# Altium schematic sheet POWR0005.SchDoc: BLUEsat Power Switch
size A3; Engineer: Ekramul Nafis Islam; Organization: BLUEsat; Address1: Room 419; Address2: School of EET; Address3: UNSW; Address4: 2052; DocumentNumber: POWR0005; SheetNumber: 1; SheetTotal: 1; Description: Generic LDO-based power switch; Version: 1.0
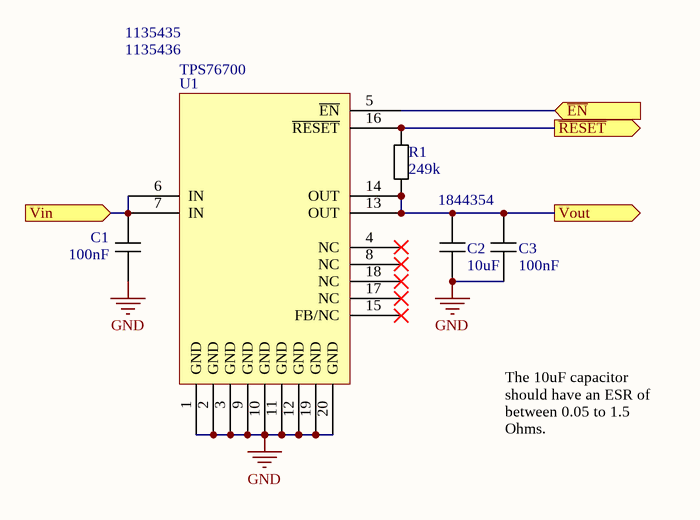
[diagram p0: POWR0005.SchDoc]

## Parts
C1  value 100nF  [0805 Cap]  (hidden comment: 0805 Cap)
C2  value 10uF  Supplier Part Number 1: 1844354  [1210 Cap]  (hidden comment: 1210 Cap)
C3  value 100nF  [0805 Cap]  (hidden comment: 0805 Cap)
R1  value 249k  [0805 Resistor]  (hidden comment: 0805 Resistor)
U1  TPS76700  Supplier Part Number 1: 1135436  Supplier Part Number 2: 1135435  [SOP-20 TPS76700]

## Ports
Vin (in), Vout (out), ~{EN} (in), ~{RESET} (out)

## Nets
GND: C1.1 C2.1 C3.1 U1.1(GND) U1.2(GND) U1.3(GND) U1.9(GND) U1.10(GND) U1.11(GND) U1.12(GND) U1.19(GND) U1.20(GND)
~{EN}: U1.5(~{EN}) ; port ~{EN}
~{RESET}: R1.2 U1.16(~{RESET}) ; port ~{RESET}
Vin: C1.2 U1.6(IN) U1.7(IN) ; port Vin
Vout: C2.2 C3.2 R1.1 U1.13(OUT) U1.14(OUT) ; port Vout

Not connected (* = marked no-connect by the designer): U1 4(NC)* 8(NC)* 15(FB/NC)* 17(NC)* 18(NC)*

## Notes on the sheet
- The 10uF capacitor should have an ESR of between 0.05 to 1.5 Ohms.
- Title
- Description:
- Size:
- Author:
- Date:
- A3
- Time:
- Version
- Sheet:
- Drawing No.:
- of
- File:

## Library data of the parts
C1 C3 = 0805 MLCC - X7R, 10%
C2 = 1210 MLCC - X7R, 10%: Supplier 1: Farnell
R1 = 0805 Thick Film Resistor 1%
U1 = TPS76700: LDO Regulator - ER; Supplier 1: Farnell; Supplier 2: Farnell